# Altium schematic sheet sheet1.SchDoc
size A4; SheetNumber: 1; SheetTotal: 2
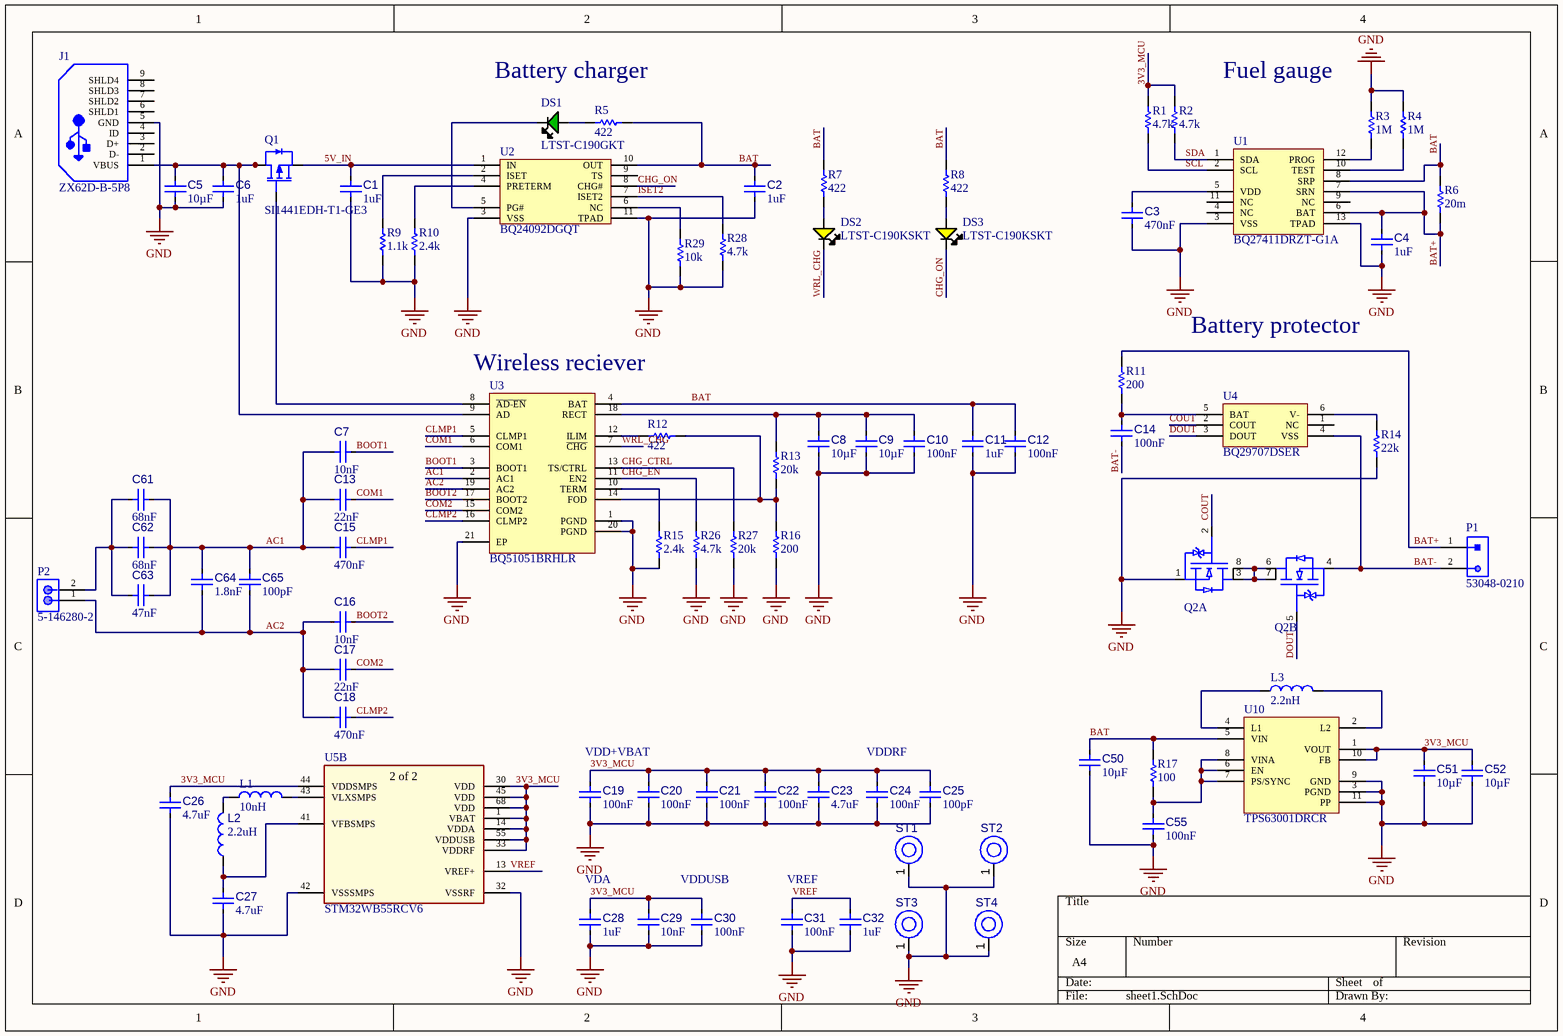
[diagram p0: sheet1.SchDoc]

## Parts
C1  value 1uF  [0603-SMD-CAP]  (hidden comment: C0603C105K3PACTU)
C2  value 1uF  [0603-SMD-CAP]  (hidden comment: C0603C105K3PACTU)
C3  value 470nF  [CAPC0603(1608)100_L]  (hidden comment: Capacitor 470nF +/-20% 25V 0603)
C4  value 1uF  [0603-SMD-CAP]  (hidden comment: C0603C105K3PACTU)
C5  value 10µF  [0603-SMD-CAP]  (hidden comment: 0603ZD106KAT2A)
C6  value 1uF  [0603-SMD-CAP]  (hidden comment: C0603C105K3PACTU)
C7  value 10nF  [0402-SMD-CAP]  (hidden comment: CL05B103KB5NNNC)
C8  value 10µF  [0603-SMD-CAP]  (hidden comment: 0603ZD106KAT2A)
C9  value 10µF  [0603-SMD-CAP]  (hidden comment: 0603ZD106KAT2A)
C10  value 100nF  [0402-SMD-CAP]  (hidden comment: EMF105B7104MVHF)
C11  value 1uF  [0603-SMD-CAP]  (hidden comment: C0603C105K3PACTU)
C12  value 100nF  [0402-SMD-CAP]  (hidden comment: EMF105B7104MVHF)
C13  value 22nF  [0402-SMD-CAP]  (hidden comment: CC0402KRX7R8BB223)
C14  value 100nF  [0402-SMD-CAP]  (hidden comment: EMF105B7104MVHF)
C15  value 470nF  [0402-SMD-CAP]  (hidden comment: C1005X5R1E474K050BB)
C16  value 10nF  [0402-SMD-CAP]  (hidden comment: CL05B103KB5NNNC)
C17  value 22nF  [0402-SMD-CAP]  (hidden comment: CC0402KRX7R8BB223)
C18  value 470nF  [0402-SMD-CAP]  (hidden comment: C1005X5R1E474K050BB)
C19  value 100nF  [0402-SMD-CAP]  (hidden comment: EMF105B7104MVHF)
C20  value 100nF  [0402-SMD-CAP]  (hidden comment: EMF105B7104MVHF)
C21  value 100nF  [0402-SMD-CAP]  (hidden comment: EMF105B7104MVHF)
C22  value 100nF  [0402-SMD-CAP]  (hidden comment: EMF105B7104MVHF)
C23  value 4.7uF  [0603-SMD-CAP]  (hidden comment: C0603C475K9PACTU)
C24  value 100nF  [0402-SMD-CAP]  (hidden comment: EMF105B7104MVHF)
C25  value 100pF  [0402-SMD-CAP]  (hidden comment: 04025A101JAT2A)
C26  value 4.7uF  [0603-SMD-CAP]  (hidden comment: C0603C475K9PACTU)
C27  value 4.7uF  [0603-SMD-CAP]  (hidden comment: C0603C475K9PACTU)
C28  value 1uF  [0603-SMD-CAP]  (hidden comment: C0603C105K3PACTU)
C29  value 10nF  [0402-SMD-CAP]  (hidden comment: CC0402KRX7R7BB103)
C30  value 100nF  [0402-SMD-CAP]  (hidden comment: EMF105B7104MVHF)
C31  value 100nF  [0402-SMD-CAP]  (hidden comment: EMF105B7104MVHF)
C32  value 1uF  [0603-SMD-CAP]  (hidden comment: C0603C105K3PACTU)
C50  value 10µF  [0603-SMD-CAP]  (hidden comment: 0603ZD106KAT2A)
C51  value 10µF  [0603-SMD-CAP]  (hidden comment: 0603ZD106KAT2A)
C52  value 10µF  [0603-SMD-CAP]  (hidden comment: 0603ZD106KAT2A)
C55  value 100nF  [0402-SMD-CAP]  (hidden comment: EMF105B7104MVHF)
C61  value 68nF  [0603-SMD-CAP]  (hidden comment: 06035C683KAT2A)
C62  value 68nF  [0603-SMD-CAP]  (hidden comment: 06035C683KAT2A)
C63  value 47nF  [0603-SMD-CAP]  (hidden comment: 06035G473ZAT2A)
C64  value 1.8nF  [0603-SMD-CAP]  (hidden comment: 06031C182JAT2A)
C65  value 100pF  [0402-SMD-CAP]  (hidden comment: 04025A101JAT2A)
DS1  LTST-C190GKT  [LTST-C190GKT_V]
DS2  LTST-C190KSKT  [LTST-C190KSKT_V]
DS3  LTST-C190KSKT  [LTST-C190KSKT_V]
J1  ZX62D-B-5P8  [HIRO-ZX62D-B-5P8_V]
L1  value 10nH  [0603-SMD-IND]  (hidden comment: B82496C3100J000)
L2  value 2.2uH  [0603-SMD-IND]  (hidden comment: CVH160808-2R2M)
L3  value 2.2nH  [0603-SMD-IND]  (hidden comment: B82496C3229A)
P1  53048-0210  [PHOE-1803277_V]
P2  5-146280-2  [TECO-5-146280-2_V]
Q1  SI1441EDH-T1-GE3  [SOT23127P600-8N]
Q2  CSD85301Q2  [SON65P200X80_HS-7N]  (value not drawn)  (parts A,B of 2)
R1  value 4.7k  [0603-SMD-RES]  (hidden comment: ERJ-3EKF4701V)
R2  value 4.7k  [0603-SMD-RES]  (hidden comment: ERJ-3EKF4701V)
R3  value 1M  [0603-SMD-RES]  (hidden comment: CR0603-JW-105ELF)
R4  value 1M  [0603-SMD-RES]  (hidden comment: CR0603-JW-105ELF)
R5  value 422  [0402_SMD_RES]  (hidden comment: ERJ-2RKF4220X)
R6  value 20m  [Chip2PinSM127P600-8N]  (hidden comment: WSLP1206R0200FEA)
R7  value 422  [0402_SMD_RES]  (hidden comment: ERJ-2RKF4220X)
R8  value 422  [0402_SMD_RES]  (hidden comment: ERJ-2RKF4220X)
R9  value 1.1k  [0603-SMD-RES]  (hidden comment: CRCW06031K10FKEA)
R10  value 2.4k  [0603-SMD-RES]  (hidden comment: ERJ-3EKF2401V)
R11  value 200  [0402_SMD_RES]  (hidden comment: CRCW0402200RFKED)
R12  value 422  [0402_SMD_RES]  (hidden comment: ERJ-2RKF4220X)
R13  value 20k  [0402_SMD_RES]  (hidden comment: CRCW040220K0FKED)
R14  value 22k  [0603-SMD-RES]  (hidden comment: CRCW060322K0FKEA)
R15  value 2.4k  [0603-SMD-RES]  (hidden comment: ERJ-3EKF2401V)
R16  value 200  [0402_SMD_RES]  (hidden comment: CRCW0402200RFKED)
R17  value 100  [0603-SMD-RES]  (hidden comment: CRCW0603100RFKEA)
R26  value 4.7k  [0603-SMD-RES]  (hidden comment: ERJ-3EKF4701V)
R27  value 20k  [0603-SMD-RES]  (hidden comment: CRCW060320K0FKEA)
R28  value 4.7k  [0603-SMD-RES]  (hidden comment: ERJ-3EKF4701V)
R29  value 10k  [0402_SMD_RES]  (hidden comment: CRCW040210K0FKTD)
ST1  PTH-M2D5X5  [PTH-M2D5X5]  (value not drawn)
ST2  PTH-M2D5X5  [PTH-M2D5X5]  (value not drawn)
ST3  PTH-M2D5X5  [PTH-M2D5X5]  (value not drawn)
ST4  PTH-M2D5X5  [PTH-M2D5X5]  (value not drawn)
U1  BQ27411DRZT-G1A  [SON40P400X100_HS-13N]
U2  BQ24092DGQT  [TSSOP50P490X110_HS-11L]
U3  BQ51051BRHLR  [RHL0020A_V]
U4  BQ29707DSER  [SON50P150X80-6N]
U5  STM32WB55RCV6  [QFN40P800X800X100_HS-69N]  (part B of 2)
U10  TPS63001DRCR  [DRC0010J_V]

## Nets
GND: C1.2 C2.2 C3.2 C4.2 C5.1 C6.2 C8.1 C9.1 C10.2 C11.2 C12.2 C19.2 C20.2 C21.2 C22.2 C23.2 C24.2 C25.2 C26.2 C27.2 C28.2 C29.2 C30.2 C31.2 C32.2 C50.1 C51.1 C52.1 C55.2 J1.5(GND) Q2.1(S) R3.2 R4.2 R9.1 R10.1 R14.1 R15.1 R16.1 R26.1 R27.1 R28.1 R29.2 ST1.1(H1) ST2.1(H1) ST3.1(H1) ST4.1(H1) U1.3(VSS) U1.13(TPAD) U2.3(VSS) U2.11(TPAD) U3.1(PGND) U3.20(PGND) U3.21(EP) U5.32(VSSRF) U5.42(VSSSMPS) U10.3(PGND) U10.9(GND) U10.11(PP)
3V3_MCU: C19.1 C20.1 C21.1 C22.1 C23.1 C24.1 C25.1 C26.1 C28.1 C29.1 C30.1 C51.2 C52.2 R1.2 R2.2 U5.1(VBAT) U5.14(VDDA) U5.30(VDD) U5.33(VDDRF) U5.44(VDDSMPS) U5.45(VDD) U5.55(VDDUSB) U5.68(VDD) U10.1(VOUT) U10.10(FB)
5V_IN: C1.1 Q1.4(SOURCE) U2.1(IN)
AC1: C7.1 C13.1 C15.1 C61.2 C62.2 C63.2 C64.1 C65.1 U3.2(AC1)
AC2: C16.1 C17.1 C18.1 C64.2 C65.2 P2.1 U3.19(AC2)
BAT: C2.1 C11.1 C12.1 C50.2 R5.1 R6.2 R7.2 R8.2 R17.2 U1.8(SRP) U2.10(OUT) U3.4(BAT) U10.5(VIN)
BAT+: C4.1 P1.1 R6.1 R11.2 U1.6(BAT) U1.7(SRN)
BAT-: C14.2 P1.2 Q2.4(S) U4.4(VSS)
BOOT1: C7.2 U3.3(BOOT1)
BOOT2: C16.2 U3.17(BOOT2)
CHG_CTRL: R27.2 U3.13(TS/CTRL)
CHG_EN: R26.2 U3.11(EN2)
CHG_ON: DS3.2(K) U2.8(CHG#)
CLMP1: C15.2 U3.5(CLMP1)
CLMP2: C18.2 U3.16(CLMP2)
COM1: C13.2 U3.6(COM1)
COM2: C17.2 U3.15(COM2)
COUT: Q2.2(G) U4.2(COUT)
DOUT: Q2.5(G) U4.3(DOUT)
ISET2: R28.2 U2.7(ISET2)
SCL: R1.1 U1.2(SCL)
SDA: R2.1 U1.1(SDA)
VREF: C31.1 C32.1 U5.13(VREF+)
WRL_CHG: DS2.2(K) U3.7(~{CHG})
NetC3_1: C3.1 U1.5(VDD)
NetC5_2: C5.2 C6.1 J1.1(VBUS) Q1.1(DRAIN) Q1.2(DRAIN) Q1.5(DRAIN) Q1.6(DRAIN) U3.9(AD)
NetC8_2: C8.2 C9.2 C10.1 R13.2 U3.18(RECT)
NetC14_1: C14.1 R11.1 U4.5(BAT)
NetC27_1: C27.1 L2.1 U5.41(VFBSMPS)
NetC55_1: C55.1 R17.1 U10.6(EN) U10.7(PS/SYNC) U10.8(VINA)
NetC61_1: C61.1 C62.1 C63.1 P2.2
NetDS1_1: DS1.1(A) R5.2
NetDS1_2: DS1.2(K) U2.5(PG#)
NetDS2_1: DS2.1(A) R7.1
NetDS3_1: DS3.1(A) R8.1
NetL1_1: L1.1 L2.2
NetL1_2: L1.2 U5.43(VLXSMPS)
NetL3_1: L3.1 U10.4(L1)
NetL3_2: L3.2 U10.2(L2)
NetQ1_3: Q1.3(GATE) U3.8(~{AD-EN})
NetQ2_3: Q2.3(D) Q2.6(D) Q2.7(D) Q2.8(D)
NetR3_1: R3.1 U1.12(PROG)
NetR4_1: R4.1 U1.10(TEST)
NetR9_2: R9.2 U2.2(ISET)
NetR10_2: R10.2 U2.4(PRETERM)
NetR12_1: R12.1 U3.12(ILIM)
NetR12_2: R12.2 R13.1 R16.2 U3.14(FOD)
NetR14_2: R14.2 U4.6(V-)
NetR15_2: R15.2 U3.10(TERM)
NetR29_1: R29.1 U2.6(NC)

Not connected (* = marked no-connect by the designer): J1 2(D-) 3(D+) 4(ID) 6(SHLD1) 7(SHLD2) 8(SHLD3) 9(SHLD4); U1 4(NC) 9(NC) 11(NC); U2 9(TS); U4 1(NC)

## Notes on the sheet
- Battery charger
- Fuel gauge
- (near U3) Wireless reciever
- Battery protector
- VDD+VBAT
- VDDRF
- (near C28) VDA
- VDDUSB
- (near C31) VREF
- (in symbol CMP-020-00023-6, part B) 2 of 2

## Library data of the parts
C1 C2 C4 C6 C11 C28 C32 = CMP-001-00097-4: KEMET - C0603C105K3PACTU - SMD Multilayer Ceramic Capacitor, 1 µF, 25 V, 0603 [1608 Metric], ± 10%, X5R, C Series KEMET; Voltage: 25V; Case/Package: 0603; REACH SVHC: No SVHC; Mount: Surface Mount,PCB; Tolerance: 10%; Number of Pins: 2; Case Code (Imperial): 0603; Package Quantity: 4000; Max Operating Temperature: 85°C; Case Code (Metric): 1608; Construction: Flat; Voltage Rating: 25V; Contact Plating: Tin,Matte; Min Operating Temperature: -55°C; Capacitance: 1uF; Termination: SMD/SMT; Radiation Hardening: No; Height: 0.8mm; Packaging: Tape and Reel; Series: C0603C; Depth: 0.8mm; Dielectric Material: Ceramic; Voltage Rating (DC): 25V; Lead Free: Lead Free; Mfr. Part No.: C0603C105K3PACTU; Thickness: 0.034inch; Width: 0.031inch; RoHS Compliant: Yes; Length: 1.6mm; Dielectric: X5R
C3 = CMP-001-00077-7: Chip Capacitor, 470nF +/-20%, 25V, 0603, Thickness 1 mm; Tolerance: 10%; Min Operating Temperature: -55°C; Mounting Technology: SMT; Max Operating Temperature: 85°C; Pins: 2; Voltage Rating: 25V; Case/Package: 0603
C5 C8 C9 C50-C52 = CMP-001-00075-13: Chip Capacitor, 10µF +/-20%, 10V, 0603, Thickness 1 mm; Tolerance: 10%; Voltage Rating: 10V; Pins: 2; Mfr. Part No.: 0603ZD106KAT2A; Case/Package: 0603; Mounting Technology: SMT; Min Operating Temperature: -55°C; Max Operating Temperature: 85°C
C7 C16 = CMP-001-00095-3: Cap Ceramic 0.01uF 50V X7R 10% SMD 0402 125C Paper T/R; Mount: Surface Mount; Min Operating Temperature: -55°C; Package Quantity: 1; Depth: 0.5mm; Height: 0.5mm; Dielectric: X7R; Tolerance: 10%; Width: 0.02inch; Capacitance: 10nF; Lead Free: Lead Free; Voltage Rating (DC): 50V; Construction: Flat; Case/Package: 0402; RoHS Compliant: Yes; Voltage: 50V; Thickness: 0.022inch; Case Code (Imperial): 0402; Radiation Hardening: No; Length: 1mm; Contact Plating: Tin; Max Operating Temperature: 125°C; Material: Ceramic; Series: CL; Voltage Rating: 50V; Packaging: Tape and Reel; Case Code (Metric): 1005
C10 C12 C14 C19-C22 C24 C30 C31 C55 = CMP-001-00001-15: Chip Capacitor, 0.1 uF, +/- 5%, 16 V, 0402 (1005 Metric); Voltage Rating: 16V; Capacitor Type: Ceramic; Tolerance: 5%; Case/Package: 0402; Max Operating Temperature: 125°C; RoHS Compliant: True; Pins: 2; Mounting Technology: SM; Mfr. Part No.: EMF105B7104MVHF; Min Operating Temperature: -55°C
C13 C17 = CMP-001-00098-2: 0402 22 nF 25 V ±10 % Tolerance X7R SMT Multilayer Ceramic Capacitor; Tolerance: 10%; Voltage Rating: 25V; Series: CC; Thickness: 0.022inch; Weight: 2.3E-05oz; Packaging: Tape and Reel; Mount: Surface Mount; Length: 1mm; Resistor Type: Ceramic; Capacitance: 22nF; Width: 0.02inch; Height: 0.5mm; Case/Package: 0402; Case Code (Metric): 1005; Halogen Free: Halogen Free; Case Code (Imperial): 0402; Radiation Hardening: No; Depth: 0.5mm; Max Operating Temperature: 125°C; Lead Free: Lead Free; RoHS Compliant: Yes; Number of Pins: 2; Mfr. Part No.: CC0402KRX7R8BB223; Min Operating Temperature: -55°C; Dielectric: X7R; Termination: SMD/SMT; Voltage Rating (DC): 25V
C15 C18 = CMP-001-00100-2: TDK         C1005X5R1E474K050BB            CERAMIC CAPACITOR, 0.47UF, 25V, X5R, 0402; Dissipation Factor: 10%; Termination: SMD/SMT; RoHS Compliant: Yes; Min Operating Temperature: -55°C; Series: C; Height: 0.5mm; Case Code (Metric): 1005; Capacitance: 470nF; Mount: Surface Mount; Max Operating Temperature: 85°C; Length: 1mm; Mfr. Part No.: C1005X5R1E474K050BB; Package Quantity: 10000; Case Code (Imperial): 0402; Depth: 0.5mm; Dielectric Material: Ceramic; Thickness: 500um; Radiation Hardening: No; Dielectric: X5R; Width: 0.02inch; Voltage: 25V; Construction: Flat; Voltage Rating: 25V; Tolerance: 10%; Lead Free: Lead Free; Voltage Rating (DC): 25V; Case/Package: 0402; Weight: 2.3E-05oz; Resistor Type: Ceramic; REACH SVHC: No SVHC; Packaging: Tape and Reel
C23 C26 C27 = CMP-001-00092-9: KEMET - C0603C475K9PACTU - SMD Multilayer Ceramic Capacitor, 4.7 µF, 6.3 V, 0603 [1608 Metric], ± 10%, X5R, C Series KEMET; Voltage Rating (DC): 6.3V; Dissipation Factor: 5%; Case Code (Metric): 1608; Dielectric: X5R; Radiation Hardening: No; Package Quantity: 1; Tolerance: 10%; Dielectric Material: Ceramic; Construction: Flat; Length: 1.6mm; Capacitance: 4.7uF; Lead Pitch: 0.7mm; REACH SVHC: No SVHC; Termination: SMD/SMT; Thickness: 0.035inch; Number of Pins: 2; Case Code (Imperial): 0603; Min Operating Temperature: -55°C; Depth: 0.8mm; Voltage Rating: 6.3V; RoHS Compliant: Yes; Packaging: Tape and Reel; Max Operating Temperature: 85°C; Mount: Surface Mount,PCB; Voltage: 6.3V; Series: C; Width: 0.031inch; Height: 0.8mm; Lead Free: Lead Free; Contact Plating: Tin,Matte; Case/Package: 0603
C25 C65 = CMP-001-00004-2: Capacitor, Ceramic; 100pf; Chip; Case 0402; Npo; +/-5%; 50wvdc; Smd; 2.5% Df; Tr; Insulation Resistance: 1GR; Temperature Coefficient: 30ppm/°C; Voltage Rating (DC): 50V; Dielectric: C0G; Tolerance: 5%; Radiation Hardening: No; Height: 0.56mm; Dissipation Factor: 2.5%; REACH SVHC: No SVHC; Width: 0.02inch; Construction: Flat; Series: -; Depth: 0.5mm; Packaging: Tape and Reel; Min Operating Temperature: -55°C; Voltage: 50V; Thickness: 0.022inch; Termination: SMD/SMT; Capacitance: 100pF; Mount: Surface Mount,PCB; Voltage Rating: 50V; Max Operating Temperature: 125°C; Package Quantity: 1; Lead Free: Lead Free; Case Code (Imperial): 0402; Length: 1mm; Contact Plating: Tin,Matte; Mfr. Part No.: 04025A101JAT2A; RoHS Compliant: Yes; Case/Package: 0402; Case Code (Metric): 1005
C29 = CMP-001-00003-2: CAP CER 10000PF 16V X7R 0402; Insulation Resistance: 10GR; Dissipation Factor: 3.5%; Tolerance: 10%; Case Code (Metric): 1005; Voltage Rating: 16V; Depth: 0.5mm; Number of Pins: 2; Halogen Free: Halogen Free; Mfr. Part No.: CC0402KRX7R7BB103; Length: 1mm; Case/Package: 0402; Mount: Surface Mount; Voltage Rating (DC): 16V; Lead Free: Lead Free; Series: CC; Termination: SMD/SMT; Capacitance: 10nF; Min Operating Temperature: -55°C; Case Code (Imperial): 0402; Voltage: 16V; REACH SVHC: No SVHC; Dielectric: X7R; Packaging: Tape and Reel; RoHS Compliant: Yes; Height: 0.5mm; Radiation Hardening: No; Thickness: 0.022inch; Width: 0.02inch; Package Quantity: 1; Max Operating Temperature: 125°C
C61 C62 = CMP-001-00013-2: Cap Ceramic 0.068uF 50V X7R 10% SMD 0603 125C Paper T/R; Dissipation Factor: 2.5%; Width: 0.81mm; Thickness: 0.035inch; Series: -; Mount: Surface Mount; Voltage: 50V; Case Code (Metric): 1608; Contact Plating: Tin,Matte; Construction: Flat; Termination: SMD/SMT; RoHS Compliant: Yes; Radiation Hardening: No; Max Operating Temperature: 125°C; Dielectric: X7R; Packaging: Tape and Reel; REACH SVHC: Unknown; Capacitance: 68nF; Tolerance: 10%; Voltage Rating (DC): 50V; Voltage Rating: 50V; Case/Package: 0603; Height: 0.9mm; Mfr. Part No.: 06035C683KAT2A; Min Operating Temperature: -55°C; Lead Free: Lead Free; Depth: 0.81mm; Package Quantity: 4000; Number of Pins: 2; Case Code (Imperial): 0603; Length: 1.6mm
C63 = CMP-001-00012-3: AVX 47nF Multilayer Ceramic Capacitor (MLCC) 50 V dc -20  80% Y5V dielectric Standard Surface Mount; Voltage Rating (DC): 50V; Lead Free: Lead Free; Height: 0.9mm; Termination: SMD/SMT; Width: 0.032inch; Thickness: 0.035inch; Case Code (Metric): 1608; Series: -; Case Code (Imperial): 0603; Number of Pins: 2; Dielectric: Y5V; Length: 0.063inch; Voltage Rating: 50V; Radiation Hardening: No; RoHS Compliant: Yes; Voltage: 50V; Min Operating Temperature: -30°C; Tolerance: 80%; Capacitance: 47nF; Case/Package: 0603; Mfr. Part No.: 06035G473ZAT2A; Packaging: Tape and Reel; Max Operating Temperature: 85°C; Dielectric Material: Ceramic; Mount: Surface Mount; Construction: Flat; REACH SVHC: No SVHC; Depth: 0.81mm; Package Quantity: 1
C64 = CMP-001-00011-2: AVX - 06031C182JAT2A - SMD Multilayer Ceramic Capacitor, 1800 pF, 100 V, 0603 [1608 Metric], ± 5%, X7R, AVX 0603 MLCC; Voltage Rating (DC): 100V; Dissipation Factor: 2.5%; Max Operating Temperature: 125°C; Mfr Part No.: 06031C182JAT2A; RoHS Compliant: Yes; Case Code (Imperial): 0603; Depth: 0.81mm; Packaging: Tape and Reel; Width: 0.81mm; Thickness: 0.035inch; Voltage Rating: 100V; Termination: SMD/SMT; Case/Package: 0603; Tolerance: 5%; Capacitance: 1.8nF; Dielectric: X7R; Mount: Surface Mount; Construction: Flat; Length: 1.6mm; Contact Plating: Tin,Matte; Series: -; REACH SVHC: No SVHC; Min Operating Temperature: -55°C; Package Quantity: 1; Case Code (Metric): 1608; Radiation Hardening: No; Dielectric Material: Ceramic; Lead Free: Lead Free
DS1 = CMP-007-00022-3: LED Uni-Color Green, 100 mW, 30 mA, -55 to 85 degC, 2-Pin SMD, RoHS, Tape and Reel; Manufacturer: Lite-On; Viewing Angle: 130degrees; Luminous Intensity: 6mcd; Power: 100mW; Lens Style: Clear; Forward Current: 20mA; Nominal Vf: 2.1V; Max Operating Temperature: 85°C; Package Reference: C190GKT; Datasheet URL: http://datasheet.octopart.com/LTST-C190GKT-Lite-On-datasheet-158530.pdf; Datasheet Version: Dec-06; RoHS Compliant: True; Packaging: TapeandReel; Pins: 2; Package Quantity: 3000; Package Description: 2-Pin Surface Mount Device, Body 1.6 x 0.8 mm; Illumination Colour: Green; Manufacturer URL: http://www.us.liteon.com/; Colour: Green; Min Operating Temperature: -55°C; Forward Voltage: 2.1V; Case/Package: 0603; Mounting Technology: SM
DS2 DS3 = CMP-007-00025-3: LED Uni-Color Yellow, 75 mW, 30 mA, -30 to 85 degC, 2-Pin SMD, RoHS, Tape and Reel; Manufacturer: Lite-On; Nominal Vf: 2.1V; Forward Voltage: 2V; Luminous Intensity: 28mcd; Power: 75mW; Viewing Angle: 130degrees; Forward Current: 20mA; Lens Style: Diffused; Datasheet Version: Rev. I, 10/2012; Colour: Yellow; Max Operating Temperature: 85°C; Package Description: 2-Pin Surface Mount Device, Body 1.6 x 0.8 mm; Mounting Technology: SM; RoHS Compliant: True; Package Quantity: 3000; Packaging: TapeandReel; Package Reference: C190KSKT; Illumination Colour: Yellow; Datasheet URL: http://optoelectronics.liteon.com/upload/download/DS-22-99-0189/S_110_LTST-C190KSKT.pdf; Manufacturer URL: http://www.us.liteon.com/; Pins: 2; Case/Package: 0603; Min Operating Temperature: -55°C
J1 = CMP-002-00043-3: Right Angle Receptacle Connector, Micro USB, 5 Position, Height 2.65 mm, -30 to 85 degC, RoHS, Tape and Reel; Manufacturer: Hirose Electric; Current Rating: 1A; Gender: Male; Rows: 1; Min Operating Temperature: -30°C; Packaging: TapeandReel; Contact Material: Copper; Lead Pitch: 0.65mm; Package Quantity: 2000; RoHS Compliant: True; Max Operating Temperature: 85°C; Pins: 5; Datasheet URL: https://www.hirose.com/product/en/download_file/key_name/ZX62D-B-5P8/category/Catalog/doc_file_id/31704/?file_category_id=5&item_id=02420034000&is_series=; Package Description: USB Connector, 5 Position Surface Mount, Length 8 mm, Height 2.65 mm; Mounting Technology: SM; Housing Material: Plastic; Case/Package: ZX62D-B-5P8; Datasheet Version: Aug-16; Connector Type: USB; Manufacturer URL: https://www.hirose.com; Package URL: https://www.hirose.com/product/en/download_file/key_name/ZX62D-B-5P8/category/Drawing%20(2D)/doc_file_id/36535/?file_category_id=6&item_id=02420034000&is_series=; Package Reference: ZX62D-B-5P8; Contact Plating: Gold
L1 = CMP-006-00033-3: EPCOS   B82496C3100J   INDUCTOR, 0603 CASE, 10NH; Core Material: Copper,Ceramic; Inductor Type: Wirewound; Q Factor: 14; Series Resistance: 320mR; Test Frequency: 100MHz; Current Rating: 400mA; Self Resonant Frequency: 5GHz; Max DC Current: 600mA; Shielding: Unshielded; Inductance Tolerance: 5%; DC Resistance (DCR): 200mR; Inductance: 10nH; Lead Free: Lead Free; Width: 0.031inch; Height - Seated (Max): 0.035inch; Weight: 0.000141oz; Radiation Hardening: No; REACH SVHC: Unknown; Package Quantity: 4000; Depth: 0.9mm; RoHS Compliant: Yes; Max Operating Temperature: 125°C; Series: B82496C; Height: 0.8mm; Case Code (Metric): 1608; Resistor Type: Wirewound; Number of Pins: 2; Military Standard: Not; Contact Plating: Tin; Mount: Surface Mount; DC Current: 600mA; Case Code (Imperial): 0603; Packaging: Tape and Reel; Length: 1.6mm; Termination: SMD/SMT; Case/Package: 0603; Tolerance: 5%; Mfr. Part No.: B82496C3100J000; Ratings: AEC-Q200
L2 = CMP-006-00032-4: Inductor Power Shielded Multi-Layer 2.2uH 20% 1MHz Ferrite 0.75A 0.3Ohm DCR 0603 T/R; Current Rating: 750mA; Self Resonant Frequency: 50MHz; Case/Package: 0603; Shielding: Shielded; RoHS Compliant: Yes; Max Operating Temperature: 85°C; Core Material: Ferrite; Mfr. Part No.: CVH160808-2R2M; Min Operating Temperature: -40°C
L3 = CMP-006-00034-3: 2.2nH Unshielded Wirewound Inductor 1.5A 35 mOhm Max 0603 (1608 Metric); Test Frequency: 100MHz; Self Resonant Frequency: 10GHz; Core Material: Ceramic,Copper; Q Factor: 14; DC Resistance (DCR): 35mR; Ratings: AEC-Q200; Military Standard: Not; Min Operating Temperature: -55°C; Series: SIMID; Max DC Current: 1.5A; Max Operating Temperature: 150°C; Length: 1.6mm; Mount: Surface Mount; Current Rating: 1.5A; Depth: 0.9mm; Mfr. Part No.: B82496C3229A; Weight: 0.000141oz; Width: 0.031inch; Packaging: Tape and Reel; Case/Package: 0603; Package Quantity: 4000; Number of Pins: 2; Height: 0.8mm; Shielding: Unshielded; Case Code (Metric): 1608; Lead Free: Lead Free; DC Current: 1.5A; Height - Seated (Max): 0.035inch; Inductance: 2.2nH; Resistor Type: Wirewound; Case Code (Imperial): 0603; RoHS Compliant: Yes; Termination: SMD/SMT
P1 = CMP-002-00086-2: MOLEX - 53048-0210 - Wire-To-Board Connector, Right Angle, 1.25 mm, 2 Contacts, Header, PicoBlade 53048 Series; Insulation Resistance: 100MR; Pitch: 1.25mm; Voltage Rating: 125V; Contact Resistance: 20mR; Number of Contacts: 2; Current Rating: 1A; Glow Wire Compliant: Non-compliant; Gender: Male; Contact Plating: Tin; Flammability Rating: UL94 V-0; Termination: Through Hole; Number of Positions: 2; Voltage Rating (DC): 125V; Contact Material: Bronze,Brass,Tin; Orientation: Right Angle; Packaging: Tray; Lead Free: Lead Free; Max Operating Temperature: 85°C; Series: PicoBlade; REACH SVHC: Unknown; Housing Material: Nylon; Min Operating Temperature: -40°C; Color: Natural; RoHS Compliant: Yes; Number of Rows: 1; Radiation Hardening: No; Mount: Through Hole; Housing Color: Natural; Package Quantity: 5000; Number of Circuits: 2; Connector Type: Header
P2 = CMP-002-00087-2: AMPMODU 2 Position 2.54 mm Single Row Through-Hole Straight Breakaway Header; Mating Alignment: No (Without); Current Rating: 3A; PCB Thickness: 0.063inch; Approvals: CSA; Number of Contacts: 2; PCB Mount Retention: Without; Contact Post Length: 0.12inch; High Speed Serial Data Connector: No; Pitch: 2.54mm; PCB Mounting Orientation: Vertical; High Temperature Housing: Yes; Contact Current Rating: 5A; Mfr. Part No.: 5-146280-2; Contact Finish - Mating: GOLD; Contact Mating Length: 0.23inch; Stabilizers: No (Without); Min Operating Temperature: -65°C; Board Standoff: No (Without); Flammability Rating: UL94 V-0; Insulation Color: Black; Number of Rows: 1; Packaging: Carton; Contact Protection: No (Without); Selectively Loaded: No (Without); Contact Shape: Square; Fastening Type: Pull; Mount: Through Hole; Length: 4.67mm; Insulation Material: Polymer; Package Quantity: 500; Gasket: No (Without); Connector Type: Header; Row Spacing: 2.54mm; Contact Gender: Male; Series: AMPMODU MOD II; Contact Material: Copper Alloy; Contact Plating: Gold,Tin,Lead,Matte; Termination: Through Hole; Max Operating Temperature: 105°C; Number of Positions: 2; Housing Color: Black; Contact Type: Male Pin; Housing Material: Polymer; Pins: 2; Radiation Hardening: No; Depth: 2.34mm; Mating Connector Lock: No (Without); Color: Black; Orientation: Straight; Keyed: No
Q1 = CMP-013-00036-1: MOSFET -20V 41mOhm@4.5V 4A P-Ch G-III; Drain to Source Resistance: 41mR; Power Dissipation: 1.6W; Gate to Source Voltage (Vgs): 10V; Polarity: P-CHANNEL; Element Configuration: Single; Number of Elements: 1; Drain to Source Voltage (Vdss): 20V; Nominal Vgs: -400mV; Max Power Dissipation: 2.8W; Min Operating Temperature: -55°C; Weight: 0.000265oz; Mount: Surface Mount; Packaging: Tape and Reel; Number of Pins: 6; REACH SVHC: Unknown; Max Operating Temperature: 150°C; RoHS Compliant: Yes; Drain to Source Breakdown Voltage: -20V; Rds On Max: 41mR; Number of Channels: 1; Series: TrenchFET®; Package Quantity: 3000; Continuous Drain Current (ID): 4A; Lead Free: Lead Free; Radiation Hardening: No; Case/Package: SOT-363
Q2 = CMP-013-00037-4: MOSFET 2N-CH 20V 5A 6WSON; Turn-On Delay Time: 6ns; Input Capacitance: 469pF; Turn-Off Delay Time: 14ns; FET Type: 2 N-Channel; Rds On Max: 27mR; Gate to Source Voltage (Vgs): 10V; Number of Channels: 2; Drain to Source Resistance: 23mR; Max Power Dissipation: 2.3W; Fall Time: 15ns; Rise Time: 26ns; Element Configuration: Dual; Contact Plating: Tin; Packaging: Tape and Reel; Weight: 0.000342oz; Mfr. Part No.: CSD85301Q2; Min Operating Temperature: -55°C; Width: 2.1mm; Height: 0.8mm; Length: 2.1mm; Mount: Surface Mount; RoHS Compliant: Yes; Max Operating Temperature: 150°C; Package Quantity: 3000; Drain to Source Voltage (Vdss): 20V; Continuous Drain Current (ID): 5A; Number of Pins: 6; Lead Free: Lead Free
R1 R2 R26 R28 = CMP-009-00190-3: RESISTOR, 0603, 0.1W, 1%, 4K7; Temperature Coefficient: 100ppm/°C; Voltage Rating: 75V; Max Power Dissipation: 100mW; Contact Plating: Tin; Max Operating Temperature: 155°C; Depth: 0.8mm; Military Standard: Not; Radiation Hardening: No; Mount: Surface Mount; Case/Package: 0603; RoHS Compliant: Yes; Features: Automotive AEC-Q200; Lead Free: Lead Free; Case Code (Metric): 1608; Number of Pins: 2; Min Operating Temperature: -55°C; Length: 1.6mm; Package Quantity: 1; Resistance: 4.7k; Number of Terminations: 2; Termination: SMD/SMT; Series: ERJ; Construction: Rectangular; Resistance Tolerance: 1%; Voltage Rating (DC): 75V; Size Code: 0603; Width: 0.031inch; REACH SVHC: No SVHC; Power Rating: 100mW; Packaging: Tape and Reel; Resistor Type: Thick Film; Height: 0.022inch; Weight: 7.1E-05oz; Tolerance: 1%; Case Code (Imperial): 0603
R3 R4 = CMP-009-00008-3: Res Thick Film 0603 1M Ohm 5% 1/10W ±200ppm/C Molded SMD SMD Paper Tape on Plastic Reel; Power Rating: 100mW; Temperature Coefficient: 200ppm/°C; Resistance: 1MR; Voltage Rating: 50V; Contact Plating: Tin; Series: CR0603; Mfr. Part No.: CR0603-JW-105ELF; Case Code (Metric): 1608; RoHS Compliant: Yes; Construction: Rectangular; Min Operating Temperature: -55°C; Tolerance: 5%; Max Power Dissipation: 100mW; Length: 1.6mm; Termination: SMD/SMT; Depth: 0.8mm; Packaging: Tape and Reel; Width: 0.031inch; Case Code (Imperial): 0603; Package Quantity: 1; Features: Moisture Resistant; Mount: Surface Mount; Resistor Type: Thick Film; Military Standard: Not; Radiation Hardening: No; Case/Package: 0603; Thickness: 457um; Number of Terminations: 2; Max Operating Temperature: 155°C; Height: 0.022inch
R5 R7 R8 R12 = CMP-009-00196-6: Res Thick Film 0402 422 Ohm 1% 0.1W(1/10W) ±100ppm/C Molded SMD Automotive Punched T/R; Power Rating: 100mW; Resistance: 422R; Voltage Rating (DC): 50V; Temperature Coefficient: 100ppm/°C; Construction: Rectangular; Package Quantity: 1; RoHS Compliant: Yes; REACH SVHC: No SVHC; Technology: THICK FILM; Max Power Dissipation: 100mW; Height: 0.35mm; Military Standard: Not; Case Code (Metric): 1005; Features: Automotive AEC-Q200; Termination: SMD/SMT; Packaging: Tape and Reel; Mount: Surface Mount; Mfr. Part No.: ERJ-2RKF4220X; Width: 0.02inch; Resistance Tolerance: 1%; Lead Free: Lead Free; Resistor Type: Thick Film; Case/Package: 0402; Case Code (Imperial): 0402; Voltage Rating: 50V; Tolerance: 1%; Min Operating Temperature: -55°C; Series: ERJ; Length: 1mm; Contact Plating: Tin; Number of Terminations: 2; Max Operating Temperature: 155°C; Depth: 0.5mm
R6 = CMP-009-00007-1: Res Metal Strip 1206 0.02 Ohm 1% 1W 75ppm/C Molded SMD SMD T/R; Temperature Coefficient: 75ppm/°C; Resistance: 20mR; Series: WSLP; Resistance Tolerance: 1%; Features: Moisture Resistant; Power Rating: 1W; RoHS Compliant: Yes; Mfr. Part No.: WSLP1206R0200FEA; Height: 0.035inch; Resistor Type: Metal Strip; Min Operating Temperature: -65°C; Number of Terminations: 2; Width: 1.6mm; Construction: Rectangular; Size Code: 1206; Package Quantity: 1; Length: 3.2mm; Tolerance: 1%; Mount: Surface Mount; Termination: SMD/SMT; Military Standard: Not; Radiation Hardening: No; Case/Package: 1206; Depth: 1.6mm; Case Code (Metric): 3216; REACH SVHC: Unknown; Packaging: Tape and Reel; Case Code (Imperial): 1206; Max Operating Temperature: 170°C; Max Power Dissipation: 1W; Lead Free: Lead Free
R9 = CMP-009-00005-3: Resistor, Thick Film; 1.1 Kilohms; 0.10 W @   degC; + 1%; 75 V; 0603; -55  degC; Power Rating: 100mW; Resistance: 1.1kR; Voltage Rating (DC): 75V; Temperature Coefficient: 100ppm/°C; Min Operating Temperature: -55°C; Max Operating Temperature: 155°C; Features: Automotive AEC-Q200; Case Code (Metric): 1608; Case Code (Imperial): 0603; Weight: 7.1E-05oz; RoHS Compliant: Yes; Lead Free: Lead Free; Height: 0.02inch; Packaging: Tape and Reel; Mfr. Part No.: CRCW06031K10FKEA; Package Quantity: 10; Max Power Dissipation: 100mW; Width: 0.033inch; Depth: 0.85mm; Number of Pins: 2; Length: 1.55mm; Size Code: 0603; Resistor Type: Thick Film; Resistance Tolerance: 1%; Contact Plating: Tin; Termination: SMD/SMT; Military Standard: Not; Radiation Hardening: No; REACH SVHC: Unknown; Number of Terminations: 2; Series: CRCW; Construction: Rectangular; Voltage Rating: 75V; Tolerance: 1%; Case/Package: 0603
R10 R15 = CMP-009-00002-3: Res Thick Film 0603 2.4K Ohm 1% 0.1W(1/10W) }100ppm/C Molded SMD Automotive Punched T/R; Power Rating: 100mW; Voltage Rating (DC): 75V; Resistance: 2.4kR; Temperature Coefficient: 100ppm/°C; Max Operating Temperature: 155°C; Width: 0.031inch; Mfr. Part No.: ERJ-3EKF2401V; Series: ERJ; Number of Terminations: 2; Military Standard: Not; Depth: 0.8mm; Contact Plating: Tin; Package Quantity: 1; Termination: SMD/SMT; Features: Automotive AEC-Q200; Case/Package: 0603; Mount: Surface Mount; Resistor Type: Thick Film; Radiation Hardening: No; Resistance Tolerance: 1%; Case Code (Imperial): 0603; Construction: Rectangular; Case Code (Metric): 1608; Length: 1.6mm; Voltage Rating: 75V; Height: 0.022inch; Lead Free: Lead Free; RoHS Compliant: Yes; Min Operating Temperature: -55°C; REACH SVHC: No SVHC; Tolerance: 1%; Packaging: Tape and Reel; Max Power Dissipation: 100mW
R11 R16 = CMP-009-00197-4: SMD Chip Resistor, 0402 [1005 Metric], 200 ohm, CRCW e3 Series, 50 V, Thick Film, 63 mW; Max Power Dissipation: 63mW; Resistance Tolerance: 1%; Resistance: 200R; Temperature Coefficient: 100ppm/°C; Voltage Rating (DC): 50V; Radiation Hardening: No; Case Code (Metric): 1005; Number of Terminations: 2; Length: 1mm; REACH SVHC: Unknown; Width: 0.5mm; Technology: THICK FILM; Mount: Surface Mount; Series: CRCW; Min Operating Temperature: -55°C; RoHS Compliant: Yes; Packaging: Tape and Reel; Construction: Rectangular; Contact Plating: Tin; Package Quantity: 10; Resistor Type: Thick Film; Termination: SMD/SMT; Depth: 0.5mm; Max Operating Temperature: 155°C; Weight: 2.3E-05oz; Number of Pins: 2; Tolerance: 1%; Size Code: 0402; Features: Automotive AEC-Q200; Case/Package: 0402; Power Rating: 63mW; Lead Free: Lead Free; Mfr. Part No.: CRCW0402200RFKED; Voltage Rating: 50V; Height: 0.35mm; Military Standard: Not; Case Code (Imperial): 0402
R13 = CMP-009-00198-4: RES SMD 20K OHM 1% 1/16W 0402; Voltage Rating (DC): 50V; Resistance: 20kR; Power Rating: 63mW; Temperature Coefficient: 100ppm/°C; Features: Automotive AEC-Q200; Package Quantity: 10; Construction: Rectangular; Depth: 0.5mm; Height: 0.35mm; Length: 1mm; Contact Plating: Tin; REACH SVHC: Unknown; Case/Package: 0402; Military Standard: Not; Min Operating Temperature: -55°C; Max Operating Temperature: 155°C; Working Voltage: 50V; Max Power Dissipation: 63mW; Voltage Rating: 50V; Tolerance: 1%; Number of Pins: 2; Radiation Hardening: No; Width: 0.5mm; Lead Free: Lead Free; Packaging: Tape and Reel; Number of Terminations: 2; Technology: THICK FILM; Weight: 2.3E-05oz; Mount: Surface Mount; Case Code (Metric): 1005; RoHS Compliant: Yes; Resistance Tolerance: 1%; Termination: SMD/SMT; Case Code (Imperial): 0402; Series: CRCW; Mfr. Part No.: CRCW040220K0FKED; Resistor Type: Thick Film
R14 = CMP-009-00195-3: VISHAY - CRCW060322K0FKEA - Surface Mount Thick Film Resistor, AEC-Q200 CRCW Series, 22 kohm, 100 mW, - 1%, 75 V RoHS Compliant: Yes; Max Power Dissipation: 100mW; Temperature Coefficient: 100ppm/°C; Resistance: 22kR; Voltage Rating: 75V; Case Code (Metric): 1608; Case Code (Imperial): 0603; Width: 0.85mm; Mount: Surface Mount; Packaging: Tape and Reel; Weight: 7.1E-05oz; RoHS Compliant: Yes; Case/Package: 0603; Termination: SMD/SMT; Number of Terminations: 2; Min Operating Temperature: -55°C; Depth: 0.85mm; Tolerance: 1%; Package Quantity: 10; Features: Automotive AEC-Q200; Construction: Rectangular; Height: 0.45mm; Length: 1.55mm; Technology: THICK FILM; Lead Free: Lead Free; Series: CRCW; REACH SVHC: Unknown; Military Standard: Not; Resistance Tolerance: 1%; Contact Plating: Tin; Resistor Type: Thick Film; Max Operating Temperature: 155°C; Size Code: 0603; Radiation Hardening: No; Voltage Rating (DC): 75V; Power Rating: 100mW
R17 = CMP-009-00009-4: Res Thick Film 0603 100 Ohm 1% 1/10W ±100ppm/°C Molded SMD Paper T/R; Voltage Rating (DC): 75V; Max Power Dissipation: 100mW; Resistance: 100R; Series: CRCW; Max Operating Temperature: 155°C; Construction: Rectangular; Mount: Surface Mount; Case/Package: 0603; Number of Terminations: 2; Height: 0.02inch; Tolerance: 1%; Radiation Hardening: No; Number of Pins: 2; Min Operating Temperature: -55°C; Mfr. Part No.: CRCW0603100RFKEA; Case Code (Metric): 1608; Resistor Type: Thick Film; Packaging: Tape and Reel; Resistance Tolerance: 1%; Military Standard: Not; Lead Free: Lead Free; Contact Plating: Tin; Package Quantity: 10; REACH SVHC: Unknown; Weight: 7.1E-05oz; Depth: 0.85mm; Width: 0.033inch; Length: 1.55mm; Features: Automotive AEC-Q200; Temperature Coefficient: 100ppm/°C; RoHS Compliant: Yes; Voltage Rating: 75V; Power Rating: 100mW; Size Code: 0603; Case Code (Imperial): 0603; Termination: SMD/SMT
R27 = CMP-009-00191-7: VISHAY - CRCW060320K0FKEA - SMD Chip Resistor, 0603 [1608 Metric], 20 kohm, CRCW e3 Series, 75 V, Thick Film, 100 mW; Max Power Dissipation: 100mW; Tolerance: 1%; Voltage Rating: 75V; Temperature Coefficient: 100ppm/°C; RoHS Compliant: Yes; Package Quantity: 5000; Resistor Type: Thick Film; Construction: Rectangular; Width: 0.85mm; Height: 0.45mm; Number of Pins: 2; Depth: 0.85mm; Lead Free: Lead Free; Mount: Surface Mount; Case Code (Imperial): 0603; Min Operating Temperature: -55°C; REACH SVHC: Unknown; Size Code: 0603; Features: Automotive AEC-Q200; Termination: SMD/SMT; Case Code (Metric): 1608; Packaging: Tape and Reel; Contact Plating: Tin,Lead; Series: CRCW; Max Operating Temperature: 155°C; Case/Package: 0603; Resistance Tolerance: 1%; Resistance: 20k; Military Standard: Not; Power Rating: 100mW; Length: 1.55mm; Radiation Hardening: No; Voltage Rating (DC): 75V; Number of Terminations: 2; Weight: 7.1E-05oz
R29 = CMP-009-00149-12: Chip Resistor, 10 kOhms, +/-1 %, 63 mW, -55 to 125 degC, 0402; Power: 63mW; Tolerance: 1%; Case/Package: 0402; Pins: 2; Mfr. Part No.: CRCW040210K0FKTD; Max Operating Temperature: 155°C; Min Operating Temperature: -55°C
ST1-ST4 = CMP-00028-00004-1: M2 PTH (2.5mm), 5mm pad; Pins: 1
U1 = CMP-019-00060-3: IC BATT FUEL GAUGE LICOO2 12SON; Operating Supply Current: 93uA; Output Current: 500uA; Interface: I2C; Number of Cells: 1; Capacity: 8000mAh; Max Supply Voltage: 4.5V; Min Supply Voltage: 2.45V; Output Voltage: 1.8V; Packaging: Tape and Reel; Lead Free: Lead Free; Min Operating Temperature: -40°C; Package Quantity: 250; Number of Pins: 12; RoHS Compliant: Yes; Contact Plating: Gold; Mount: Surface Mount; REACH SVHC: No SVHC; Max Operating Temperature: 85°C
U2 = CMP-019-00058-5: Battery Charger Li-Ion/Li-Pol 1000mA 4.2V 10-Pin MSOP EP T/R; Min Input Voltage: 4.5V; Operating Supply Current: 800uA; Max Charge Current: 1A; Min Supply Voltage: 3.5V; Min Output Voltage: 4.16V; Number of Cells: 1; Max Supply Voltage: 12V; Max Output Voltage: 4.23V; Operating Supply Voltage: 6.5V; Lead Free: Lead Free; RoHS Compliant: Yes; Series: -; Radiation Hardening: No; Min Operating Temperature: -40°C; Number of Pins: 10; Packaging: Tape and Reel; Case/Package: MSOP; Height: 0.95mm; Max Operating Temperature: 125°C; Length: 3.1mm; Mfr. Part No.: BQ24092DGQT; Package Quantity: 1; Width: 3.1mm; Output Voltage: 4.2V; Contact Plating: Gold; REACH SVHC: No SVHC; Output Current: 1A; Max Output Current: 1A
U3 = CMP-019-00057-4: IC WIRELESS PWR RCVR 20QFN; Output Voltage: 4.35V; Operating Supply Voltage: 10V; Operating Supply Current: 8mA; Output Current: 1.5A; Logic Function: Receiver; Case/Package: VQFN; Max Operating Temperature: 125°C; Packaging: Tape and Reel; Package Quantity: 3000; Contact Plating: Gold; Mount: Surface Mount; RoHS Compliant: Yes; Series: BQ51051B; Lead Free: Lead Free; Min Operating Temperature: 0°C
U4 = CMP-019-00059-3: IC LITHIUM BATT PROTECT 6WSON; Fault Protection: Over Current,Short Circuit,Over/Under Voltage; Number of Cells: 1; Operating Supply Voltage: 28V; Lead Free: Lead Free; Contact Plating: Gold; Packaging: Tape and Reel; Mount: Surface Mount; Case/Package: WFDFN; Number of Pins: 6; Min Operating Temperature: -40°C; Max Operating Temperature: 85°C; RoHS Compliant: Yes
U5 = CMP-020-00023-6: ARM Based Multiprotocol Wireless Microcontroller 32-Bit 1.71V to 3.6V 68-Pin 256KB VFQFPN Surface Mount; Manufacturer: ST; Frequence: 64MHz; Case/Package: VFQFPN; Max Operating Temperature: 85°C; Max Supply Voltage: 3.6V; Min Operating Temperature: -40°C; Min Supply Voltage: 1.71V; Flash size: 256kB
U10 = CMP-019-00064-1: TEXAS INSTRUMENTS         TPS63001DRCR             CONVERTER, BUCK-BOOST, SON-10, FULL REEL; Output Type: Fixed; Synchronous Rectifier: Yes; Output Current: 1.2A; Min Output Voltage: 3.3V; Operating Supply Voltage: 5.5V; Efficiency: 96%; Quiescent Current: 30uA; Number of Outputs: 1; Switching Frequency: 1.5MHz; Min Input Voltage: 1.8V; Number of Pins: 10; Package Quantity: 1; Packaging: Tape and Reel; Weight: 0.000921oz; Max Output Voltage: 3.3V; Contact Plating: Gold; Max Input Voltage: 5.5V; Topology: Buck-Boost; Max Operating Temperature: 85°C; Mfr. Part No.: TPS63001DRCR; Max Output Current: 1.2A; Nominal Output Voltage: 3.3V; REACH SVHC: No SVHC; Min Operating Temperature: -40°C; Radiation Hardening: No; Output Voltage: 3.3V; Lead Free: Lead Free